# Altium schematic sheet OpenBLC_TPS61230.SchDoc
size A
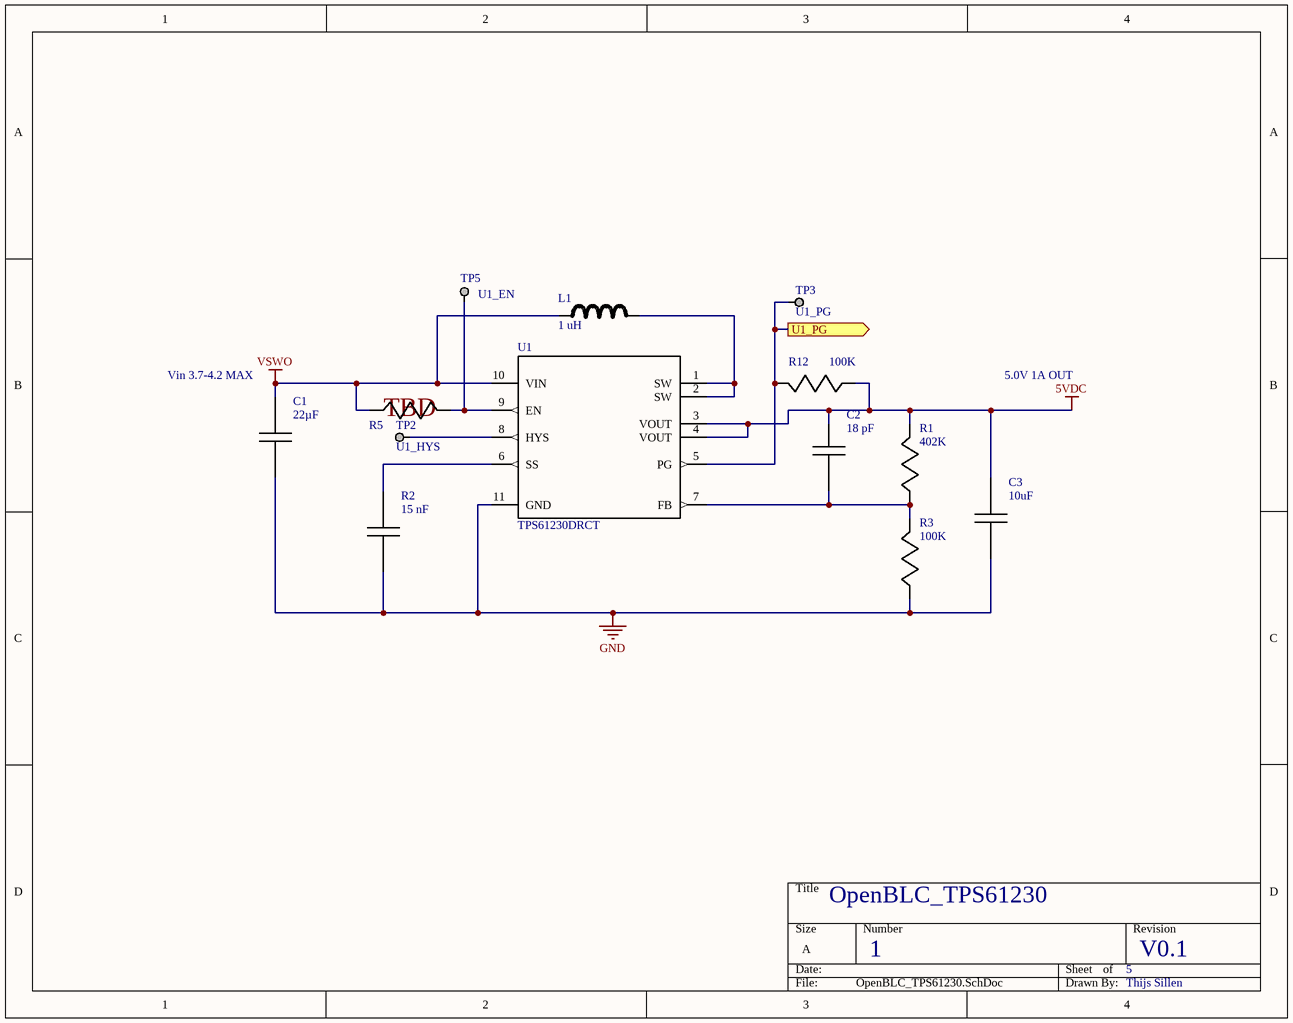
[diagram p0: OpenBLC_TPS61230.SchDoc]

## Parts
C1  Capacitance: 22µF  [0805_CAP]  (hidden comment: C2012X5R0J226M125AC)
C2  Capaciteit: 18 pF  [0603_CAP]  (hidden comment: C0603C180J5GACTU)
C3  Capacitance: 10uF  [0805_CAP]  (hidden comment: GRM21BR61A106KE19L)
L1  Inductantie: 1 uH  [SRU1028]  (hidden comment: SRU1028-1R0Y)
R1  Resistance: 402K  [0402_RES]  (hidden comment: CRCW0402402KFKED)
R2  Capaciteit: 15 nF  [0402_CAP]  (hidden comment: GRM155R71C153KA01D)
R3  Resistance: 100K  [0402_RES]  (hidden comment: CRCW0402100KFKEDHP)
R5  0805_RES  [0805_RES]  (value not drawn)
R12  Resistance: 100K  [0402_RES]  (hidden comment: CRCW0402100KFKEDHP)
TP2  U1_HYS  [Via_TP]
TP3  U1_PG  [Via_TP]
TP5  U1_EN  [Via_TP]
U1  TPS61230DRCT  [TPS61230DRCR]

## Ports
U1_PG (out)

## Nets
5VDC: C2.1 C3.1 R1.1 R12.2 U1.3(VOUT) U1.4(VOUT)
GND: C1.2 C3.2 R2.2 R3.2 U1.11(GND)
VSWO: C1.1 L1.2 R5.2 U1.10(VIN)
U1_PG: R12.1 TP3.1 U1.5(PG) ; port U1_PG
NetC2_2: C2.2 R1.2 R3.1 U1.7(FB)
NetL1_1: L1.1 U1.1(SW) U1.2(SW)
NetR2_1: R2.1 U1.6(SS)
NetR5_1: R5.1 TP5.1 U1.9(EN)
NetTP2_1: TP2.1 U1.8(HYS)

## Notes on the sheet
- (near C1) Vin 3.7-4.2 MAX
- (near R5) TBD
- 5.0V 1A OUT
- OpenBLC_TPS61230
- 1
- 5
- V0.1
- Thijs Sillen

## Library data of the parts
C1 = C2012X5R0J226M125AC: CAP CER 22UF 6.3V 20% X5R 0805; Manufacturer: TDK Corporation; Supplier 1: Digi-Key; Supplier Part Number 1: 445-1422-1-ND; RoHS: RoHS Compliant; Category: Capacitors; Stock 1: 147939; Pricing 1: 1=0.24, 10=0.204, 100=0.1021, 250=0.07656, 500=0.06762, 1000=0.05878 (EUR); Packaging: Cut Tape (CT); Tolerance: ±20%; Voltage - Rated: 6.3V; Temperature Coefficient: X5R; Mounting Type: Surface Mount, MLCC; Operating Temperature: -55°C ~ 85°C; Applications: General Purpose; Ratings: -; Package / Case: 0805 (2012 Metric); Size / Dimension: 0.079" L x 0.049" W (2.00mm x 1.25mm); Height - Seated (Max): -; Thickness (Max): 0.057" (1.45mm); Lead Spacing: -; Features: -; Lead Style: -; ComponentLink1URL: http://product.tdk.com/en/catalog/datasheets/mlcc_commercial_general_en.pdf; ComponentLink1Description: http://product.tdk.com/en/catalog/datasheets/mlcc_commercial_general_en.pdf; Manufacturer Part Number: C2012X5R0J226M125AC
C2 = C0603C180J5GACTU: Meerlaagse keramische condensatoren MLCC - SMD/SMT 50volts 18pF C0G 5%; Manufacturer: Kemet; Bedrijfstemperatuurbereik: - 55 C to + 125 C; Verpakking / doos: 0603 (1608 metric); Verpakken: Reel; Reeks: C0603C; Type: C0G Dielectric, Commercial; Nominale spanning: 50 V; Code behuizing - in: 0603; Code behuizing - mm: 1608; Hoogte behuizing: 0.8 mm; Lengte behuizing: 1.6 mm; Klasse: 1; Diëlectrisch: C0G (NP0); Verliesfactor DF: 0.5; Afstand tussen de draden: 0.7 mm; Maximale bedrijfstemperatuur: + 125 C; Minimale bedrijfstemperatuur: - 55 C; Productcategorie: 0603 SMD Ceramic Chip Capacitors; Standaard pakket hoeveelheid: 4000; Temperatuur Coëfficiënt / Code: +/- 30 PPM / C; Supplier 1: Mouser; Supplier Part Number 1: 80-C0603C180J5G; RoHS: RoHS Compliant; Category: Meerlaagse keramische condensatoren MLCC - SMD/SMT; Stock 1: 190281; Pricing 1: 1=0.080, 10=0.014, 100=0.010, 1000=0.006, 4000=0.006, 8000=0.005, 48000=0.004, 100000=0.003 (EUR); Product: General Type MLCCs; Klemtype: SMD/SMT; Tolerantie: 5 %; Nominale spanning DC: 50 V; Merk: Kemet; Breedte behuizing: 0.8 mm; Fabrikant: Kemet; RoHS - Mouser: Y; Minimum Order Quantity: 1; Reeling: True; ComponentLink1URL: http://www.kemet.com/kemet/web/homepage/kechome.nsf/vapubfiles/KEM_C1003_C0G_SMD.pdf/$file/KEM_C1003_C0G_SMD.pdf; ComponentLink1Description: http://www.kemet.com/kemet/web/homepage/kechome.nsf/vapubfiles/KEM_C1003_C0G_SMD.pdf/$file/KEM_C1003_C0G_SMD.pdf; Manufacturer Part Number: C0603C180J5GACTU
C3 = GRM21BR61A106KE19L: MURATA - GRM21BR61A106KE19L - CAPACITOR, CERA, 10UF, 10%, 10V, 10%, SMD; Product Range: MURATA - GRM Series; Dielectric Characteristic: X5; Voltage Rating: 10; Ceramic Capacitor Case: 0805 ^2012 Metric]; Supplier 1: Farnell; Supplier Part Number 1: 2396552; Manufacturer: MURATA; RoHS: YES; Stock 1: 20106; Pricing 1: 1=0.042, 250=0.039, 500=0.034, 1000=0.031, 5000=0.022 (EUR); Capacitance Tolerance: ± 10%; MSL: -; ComponentLink1URL: http://www.farnell.com/datasheets/608985.pdf; ComponentLink1Description: http://www.farnell.com/datasheets/608985.pdf; Manufacturer Part Number: GRM21BR61A106KE19L
L1 = SRU1028-1R0Y: Vaste smoorspoelen 1uH 30% SMD 1028; Manufacturer: Bourns; Kernmateriaal: Ferrite DR/RI; Maximale DC stroom: 7 A; Maximale DC weerstand: 4.9 mOhms; Bedrijfstemperatuurbereik: - 40 C to + 125 C; Verpakking / doos: 1028; Verpakken: Reel; Q minimaal: 14; Zelfresonantiefrequentie: 100 MHz; Afscherming: Shielded; Klemtype: SMD/SMT; Type: Shielded SMD Power Inductors; Hoogte behuizing: 2.8 mm; Lengte behuizing: 10 mm; Productcategorie: Inductors; Standaard pakket hoeveelheid: 1000; Testfrequentie: 7.96 MHz; Supplier 1: Mouser; Supplier Part Number 1: 652-SRU1028-1R0Y; RoHS: RoHS Compliant; Category: Vaste smoorspoelen; Stock 1: 0; Pricing 1: 1=0.660, 10=0.619, 50=0.495, 100=0.470, 200=0.429, 500=0.379, 1000=0.325 (EUR); Product: Inductors; Reeks: SRU1028; Tolerantie: 30 %; Merk: Bourns; Breedte behuizing: 10 mm; Fabrikant: Bourns; RoHS - Mouser: Y; Minimum Order Quantity: 1; Reeling: True; ComponentLink1URL: http://www.mouser.com/ds/2/54/SRU1028-54512.pdf; ComponentLink1Description: http://www.mouser.com/ds/2/54/SRU1028-54512.pdf; Manufacturer Part Number: SRU1028-1R0Y
R1 = CRCW0402402KFKED: VISHAY DRALORIC - CRCW0402402KFKED - RESISTOR, 0402, 402K, 1%; Product Range: VISHAY - CRCW Series; Power Rating: 63; Resistor Case Style: 0402 [1005 Metric]; Resistor Element Material: Thick Film; Temperature Coefficient: ± 100; Voltage Rating: 50; SVHC: No SVHC (16-Dec-2013); Resistor Mounting: SMD<!--FANDB--><div class="features-and-benefits-container"></div>; Supplier 1: Farnell; Supplier Part Number 1: 2140992; Manufacturer: VISHAY DRALORIC; RoHS: Y-EX; Stock 1: 14699; Pricing 1: 50=0.005, 250=0.004, 500=0.003, 1000=0.002, 5000=0.0014 (EUR); Resistance Tolerance: ± 1%; Packaging: Cut Tape; MSL: MSL 1 - Unlimited; ComponentLink1URL: http://www.farnell.com/datasheets/1697337.pdf; ComponentLink1Description: http://www.farnell.com/datasheets/1697337.pdf; Manufacturer Part Number: CRCW0402402KFKED
R2 = GRM155R71C153KA01D: Meerlaagse keramische condensatoren MLCC - SMD/SMT 0402 0.015uF 16volts X7R 10%; Manufacturer: Murata Electronics; Bedrijfstemperatuurbereik: - 55 C to + 125 C; Verpakking / doos: 0402 (1005 metric); Verpakken: Reel; Reeks: GRM; Nominale spanning: 16 V; Code behuizing - in: 0402; Code behuizing - mm: 1005; Hoogte behuizing: 0.5 mm; Lengte behuizing: 1 mm; Fabrikant: Murata; Maximale bedrijfstemperatuur: + 125 C; Minimale bedrijfstemperatuur: - 55 C; Productcategorie: Low & Medium Capacitance SMD Ceramic Chip Capacitors; Standaard pakket hoeveelheid: 10000; Temperatuur Coëfficiënt / Code: +/- 15 %; Supplier 1: Mouser; Supplier Part Number 1: 81-GRM155R71C153KA1D; RoHS: RoHS Compliant; Category: Meerlaagse keramische condensatoren MLCC - SMD/SMT; Stock 1: 72519; Pricing 1: 1=0.112, 10=0.014, 100=0.008, 1000=0.006, 10000=0.005, 20000=0.004, 100000=0.003 (EUR); Product: General Type MLCCs; Klemtype: SMD/SMT; Tolerantie: 10 %; Type: General Purpose MLCC; Nominale spanning DC: 16 V; Merk: Murata Electronics; Breedte behuizing: 0.5 mm; Diëlectrisch: X7R; RoHS - Mouser: Y; Minimum Order Quantity: 1; Reeling: True; ComponentLink1URL: http://psearch.murata.com/capacitor/product/GRM155R71C153KA01%23.pdf; ComponentLink1Description: http://psearch.murata.com/capacitor/product/GRM155R71C153KA01%23.pdf; Manufacturer Part Number: GRM155R71C153KA01D
R3 R12 = CRCW0402100KFKEDHP: VISHAY DRALORIC - CRCW0402100KFKEDHP - RESISTOR, POWER, 100K, 0.125W, 1%; Product Range: VISHAY - CRCW Series; Power Rating: 125; Resistor Case Style: 0402 [1005 Metric]; Resistor Element Material: Thick Film; Temperature Coefficient: ± 100; Voltage Rating: 50; SVHC: No SVHC (16-Dec-2013); External Width: 1; Resistor Mounting: SMD<!--FANDB--><div class="features-and-benefits-container"></div>; Supplier 1: Farnell; Supplier Part Number 1: 1738877; Manufacturer: VISHAY DRALORIC; RoHS: Y-EX; Stock 1: 20841; Pricing 1: 25=0.032, 100=0.024, 500=0.016, 1000=0.011, 10000=0.008 (EUR); Resistance Tolerance: ± 1%; Packaging: Cut Tape; MSL: MSL 1 - Unlimited; ComponentLink1URL: http://www.farnell.com/datasheets/1703058.pdf; ComponentLink1Description: http://www.farnell.com/datasheets/1703058.pdf; Manufacturer Part Number: CRCW0402100KFKEDHP
TP2 TP3 TP5 = TESTPOINT: TESTPOINT SCOPE GRABBER; Manufacturer Part Number: 5010; Manufacturer: Keystone Electronics; Reel: TH; Supplier 1: Digi-Key; Supplier Part Number 1: 5010K-ND
U1 = TPS61230DRCT: Manufacturer: Texas Instruments; Ingangsspanning: 2.3 V to 5.5 V; Ingangsspanning MAX.: 5.5 V; Aantal uitgangen: 1 Output; Bedrijfstemperatuurbereik: - 40 C to + 85 C; Uitgangsstroom: 2.1 A; Uitgangspanning: 2.5 V to 5.5 V; Verpakking / doos: VSON-10; Verpakken: Reel; Montagetype: SMD/SMT; Uitschakeling: Shutdown; Schakelfrequentie: 2 MHz; Topologie: Boost; Ingangsspanning MIN: 2.3 V; Maximale bedrijfstemperatuur: + 85 C; Minimale bedrijfstemperatuur: - 40 C; Product Status: New Product; Supplier 1: Mouser; Supplier Part Number 1: 595-TPS61230DRCT; RoHS: RoHS Compliant; Category: Spanningsregelaars - Schakelende regelaars; Stock 1: 464; Pricing 1: 1=2.66, 10=2.38, 25=2.14, 50=2.04, 100=1.94, 250=1.75, 500=1.58, 750=1.42, 1000=1.38 (EUR); Reeks: TPS61230; Type: Step-Up Converter; Merk: Texas Instruments; Fabrikant: Texas Instruments; Voedingsspanning - Min: 2.3 V; RoHS - Mouser: Y; Minimum Order Quantity: 1; Reeling: True; ComponentLink1URL: http://www.mouser.com/ds/2/405/slvsaq2b-350046.pdf; ComponentLink1Description: http://www.mouser.com/ds/2/405/slvsaq2b-350046.pdf; Manufacturer Part Number: TPS61230DRCT